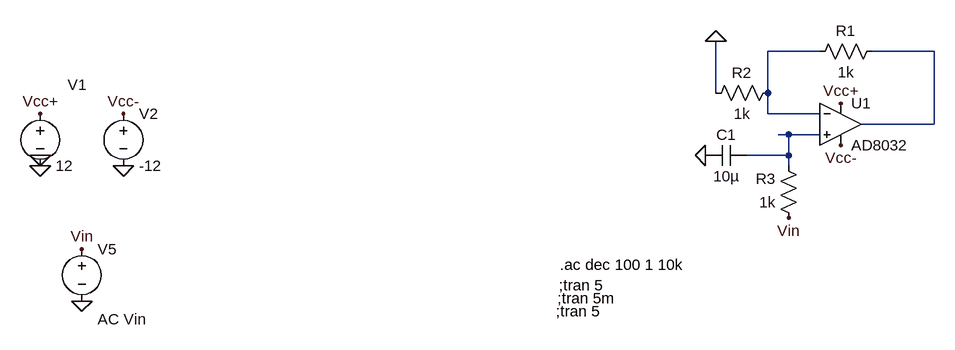
[diagram p0: schematic Low_pass_filter_official.asc]
Low_pass_filter_official.asc, the LTspice schematic file:
Version 4
SHEET 1 880 680
WIRE 128 64 48 64
WIRE 304 64 208 64
WIRE -32 128 -32 48
WIRE 48 128 48 64
WIRE 48 160 48 128
WIRE 128 160 48 160
WIRE 304 176 304 64
WIRE 304 176 192 176
WIRE 80 192 64 192
WIRE 128 192 80 192
WIRE 80 224 80 192
WIRE 80 224 16 224
WIRE 80 240 80 224
FLAG -48 224 0
FLAG -32 48 0
FLAG -1072 224 0
FLAG -1072 240 0
FLAG -944 240 0
FLAG -1008 448 0
FLAG 80 320 Vin
FLAG 160 144 Vcc+
FLAG 160 208 Vcc-
FLAG -944 160 Vcc-
FLAG -1072 160 Vcc+
FLAG -1008 368 Vin
SYMBOL OpAmps\\AD8032 160 112 R0
SYMATTR InstName U1
SYMBOL res 224 48 R90
WINDOW 0 0 56 VBottom 2
WINDOW 3 32 56 VTop 2
SYMATTR InstName R1
SYMATTR Value 1k
SYMBOL res 64 112 R90
WINDOW 0 0 56 VBottom 2
WINDOW 3 32 56 VTop 2
SYMATTR InstName R2
SYMATTR Value 1k
SYMBOL res 96 336 R180
WINDOW 0 36 76 Left 2
WINDOW 3 36 40 Left 2
SYMATTR InstName R3
SYMATTR Value 1k
SYMBOL cap 16 208 R90
WINDOW 0 0 32 VBottom 2
WINDOW 3 32 32 VTop 2
SYMATTR InstName C1
SYMATTR Value 10µ
SYMBOL voltage -1072 144 R0
WINDOW 0 42 -29 Left 2
WINDOW 123 0 0 Left 0
WINDOW 39 0 0 Left 0
SYMATTR InstName V1
SYMATTR Value 12
SYMBOL voltage -1008 352 R0
WINDOW 123 24 124 Left 2
WINDOW 39 0 0 Left 0
SYMATTR InstName V5
SYMATTR Value ""
SYMATTR Value2 AC Vin
SYMBOL voltage -944 144 R0
WINDOW 123 0 0 Left 0
WINDOW 39 0 0 Left 0
SYMATTR InstName V2
SYMATTR Value -12
TEXT -274 424 Left 2 !;tran 5
TEXT -276 444 Left 2 !;tran 5m
TEXT -278 464 Left 2 !;tran 5
TEXT -272 392 Left 2 !.ac dec 100 1 10k

The netlist it stands for:
* Low_pass_filter_official.asc
XU1 N003 N001 Vcc+ Vcc- N002 AD8032  ; pins In+ In- V+ V- OUT
R1 N002 N001 1k
R2 N001 0 1k
R3 Vin N003 1k
C1 N003 0 10µ
V1 Vcc+ 0 12
V5 Vin 0 AC Vin
V2 Vcc- 0 -12
;tran 5
;tran 5m
;tran 5
.ac dec 100 1 10k
.backanno
.end